# Altium project 短学期_功放.PrjPCB
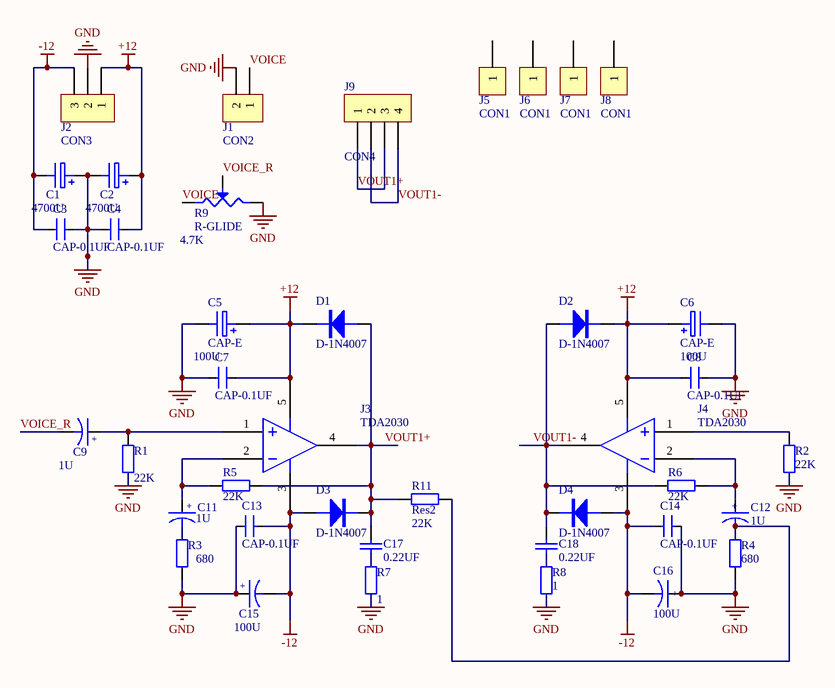
[diagram p0: 功放.SchDoc]
1 sheet, 40 parts. Net scope: global (net labels, ports and power ports of the same name join across sheets).
Board file: 功放.PcbDoc

## Sheet 功放.SchDoc
size A4

### Parts
C1  value 4700U  [4700U/35V]  (hidden comment: CAP-E)
C2  value 4700U  [4700U/35V]  (hidden comment: CAP-E)
C3  CAP-0.1UF  [0805C]
C4  CAP-0.1UF  [0805C]
C5  CAP-E  value 100U  [3528C]
C6  CAP-E  value 100U  [3528C]
C7  CAP-0.1UF  [0805C]
C8  CAP-0.1UF  [0805C]
C9  value 1U  [C3216]  (hidden comment: CAP-T)
C11  value 1U  [C3216]  (hidden comment: CAP-T)
C12  value 1U  [C3216]  (hidden comment: CAP-T)
C13  CAP-0.1UF  [0805C]
C14  CAP-0.1UF  [0805C]
C15  value 100U  [C3216]  (hidden comment: CAP-T)
C16  value 100U  [C3216]  (hidden comment: CAP-T)
C17  value 0.22UF  [RAD-0.3]  (hidden comment: Cap)
C18  value 0.22UF  [RAD-0.3]  (hidden comment: Cap)
D1  D-1N4007  [M7]
D2  D-1N4007  [M7]
D3  D-1N4007  [M7]
D4  D-1N4007  [M7]
J1  CON2  [VOICE-1]
J2  CON3  [POWER-1]
J3  TDA2030  [TDA2030]
J4  TDA2030  [TDA2030]
J5  CON1  [GDK]
J6  CON1  [GDK]
J7  CON1  [GDK]
J8  CON1  [GDK]
J9  CON4  [HB-95-4]
R1  value 22K  [0805R]  (hidden comment: Res2)
R2  value 22K  [0805R]  (hidden comment: Res2)
R3  value 680  [0805R]  (hidden comment: Res2)
R4  value 680  [0805R]  (hidden comment: Res2)
R5  value 22K  [0805R]  (hidden comment: Res2)
R6  value 22K  [0805R]  (hidden comment: Res2)
R7  value 1  [0805R]  (hidden comment: Res2)
R8  value 1  [0805R]  (hidden comment: Res2)
R9  R-GLIDE  value 4.7K  [RV09-5]
R11  Res2  value 22K  [0805R]

### Nets
+12: C2.1 C4.2 C5.1 C6.1 C7.2 C8.2 D1.2 D2.2 J2.1 J3.5 J4.5
-12: C1.2 C3.2 C13.2 C14.2 C15.2 C16.2 D3.1 D4.1 J2.3 J3.3 J4.3
GND: C1.1 C2.2 C3.1 C4.1 C5.2 C6.2 C7.1 C8.1 C13.1 C14.1 C15.1 C16.1 J1.2 J2.2 R1.1 R2.1 R3.1 R4.1 R7.1 R8.1 R9.2
VOICE: J1.1 R9.1
VOICE_R: C9.2 R9.3(W)
VOUT1+: C17.2 D1.1 D3.2 J3.4 J9.1 J9.3 R5.1 R11.1
VOUT1-: C18.2 D2.1 D4.2 J4.4 J9.2 J9.4 R6.1
NetC9_1: C9.1 J3.1 R1.2
NetC11_1: C11.1 J3.2 R5.2
NetC11_2: C11.2 R3.2
NetC12_1: C12.1 J4.2 R6.2
NetC12_2: C12.2 R4.2 R11.2
NetC17_1: C17.1 R7.2
NetC18_1: C18.1 R8.2
NetJ4_1: J4.1 R2.2

Not connected (* = marked no-connect by the designer): J5 1; J6 1; J7 1; J8 1

### Notes on the sheet
- (in symbol C) +

### Library data of the parts
C1 C2 C5 C6 = CAP-E: 电解电容
C3 C4 C7 C8 C13 C14 = CAP-0.1UF: SMD-CAP
C9 C11 C12 C15 C16 = C: 钽电容
C17 C18 = Cap: Capacitor; Published: 8-Jun-2000; LatestRevisionDate: 17-Jul-2002; LatestRevisionNote: Re-released for DXP Platform.; PackageReference: RAD-0.3; Publisher: Altium Limited
D1-D4 = D-1N4007: Diode
J1 = CON2: Connector
J2 = CON3: Connector
J5-J8 = CON1: Connector
J9 = CON4: Connector
R1-R8 R11 = Res2: Resistor; Published: 8-Jun-2000; LatestRevisionDate: 17-Jul-2002; LatestRevisionNote: Re-released for DXP Platform.; PackageReference: AXIAL-0.4; Publisher: Altium Limited